# Altium project rj45_breakout.PrjPcb
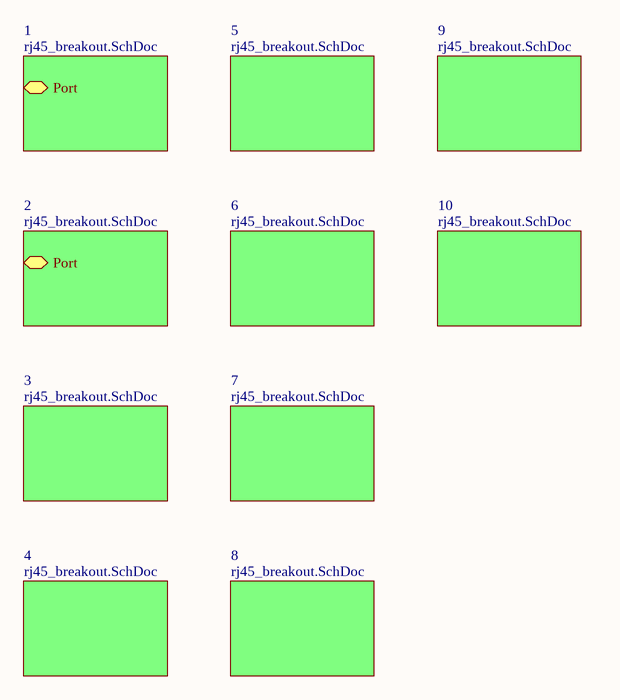
[diagram p0: breakout.SchDoc]
2 sheets, 20 parts. Net scope: hierarchical (ports join the sheet entries above them; power ports are global).
Board file: breakout.PcbDoc
Sheets:
  breakout.SchDoc
    1 = rj45_breakout.SchDoc
    2 = rj45_breakout.SchDoc
    3 = rj45_breakout.SchDoc
    4 = rj45_breakout.SchDoc
    5 = rj45_breakout.SchDoc
    6 = rj45_breakout.SchDoc
    7 = rj45_breakout.SchDoc
    8 = rj45_breakout.SchDoc
    9 = rj45_breakout.SchDoc
    10 = rj45_breakout.SchDoc

## Sheet breakout.SchDoc
size A

### Sub-sheets
1 = rj45_breakout.SchDoc: Port
2 = rj45_breakout.SchDoc: Port
3 = rj45_breakout.SchDoc: no entries
4 = rj45_breakout.SchDoc: no entries
5 = rj45_breakout.SchDoc: no entries
6 = rj45_breakout.SchDoc: no entries
7 = rj45_breakout.SchDoc: no entries
8 = rj45_breakout.SchDoc: no entries
9 = rj45_breakout.SchDoc: no entries
10 = rj45_breakout.SchDoc: no entries

## Sheet rj45_breakout.SchDoc
size A
Used 10 times, as channels 1, 2, 3, 4, 5, 6, 7, 8, 9, 10. Parts and nets are listed once, with the designators drawn on the sheet.
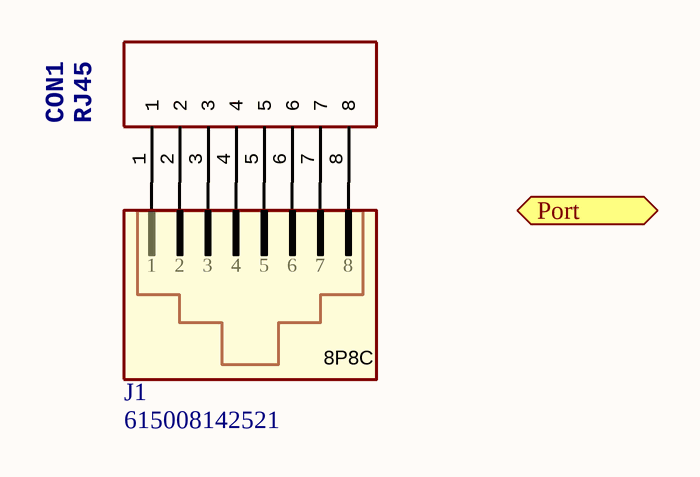
[diagram p1: rj45_breakout.SchDoc]

### Parts
CON1  RJ45  [RJ45-CHASSISCONNECTOR]
J1  615008142521  [615008142521]

### Ports
Port

### Nets
NetCON1_1: CON1.1 J1.1
NetCON1_2: CON1.2 J1.2
NetCON1_3: CON1.3 J1.3
NetCON1_4: CON1.4 J1.4
NetCON1_5: CON1.5 J1.5
NetCON1_6: CON1.6 J1.6
NetCON1_7: CON1.7 J1.7
NetCON1_8: CON1.8 J1.8

### Channels
1: designators end in _1; ports Port=open
2: designators end in _2; ports Port=open
3: designators end in _3; ports Port=open
4: designators end in _4; ports Port=open
5: designators end in _5; ports Port=open
6: designators end in _6; ports Port=open
7: designators end in _7; ports Port=open
8: designators end in _8; ports Port=open
9: designators end in _9; ports Port=open
10: designators end in _10; ports Port=open

### Library data of the parts
CON1 = RJ45-TOP: Part_Group_Name: connector; Placement_Type: 1; Part Number: RJ45-TOP
J1 = 615008142521: Part_Group_Name: connector; PinNumber: 8P8C; Placement_Type: 4; PublishedDate: July 2016; Publisher: Wurth Elektronik; ComponentLink1Description: Manufacturer; ComponentLink1URL: http://www.we-online.de; ComponentLink2Description: Datasheet; ComponentLink2URL: http://katalog.we-online.de/em/datasheet/615008142521.pdf; PartNumber: 615008142521; Part Number: 615008142521